# EAGLE design bms_board (EAGLE 6.6.0)
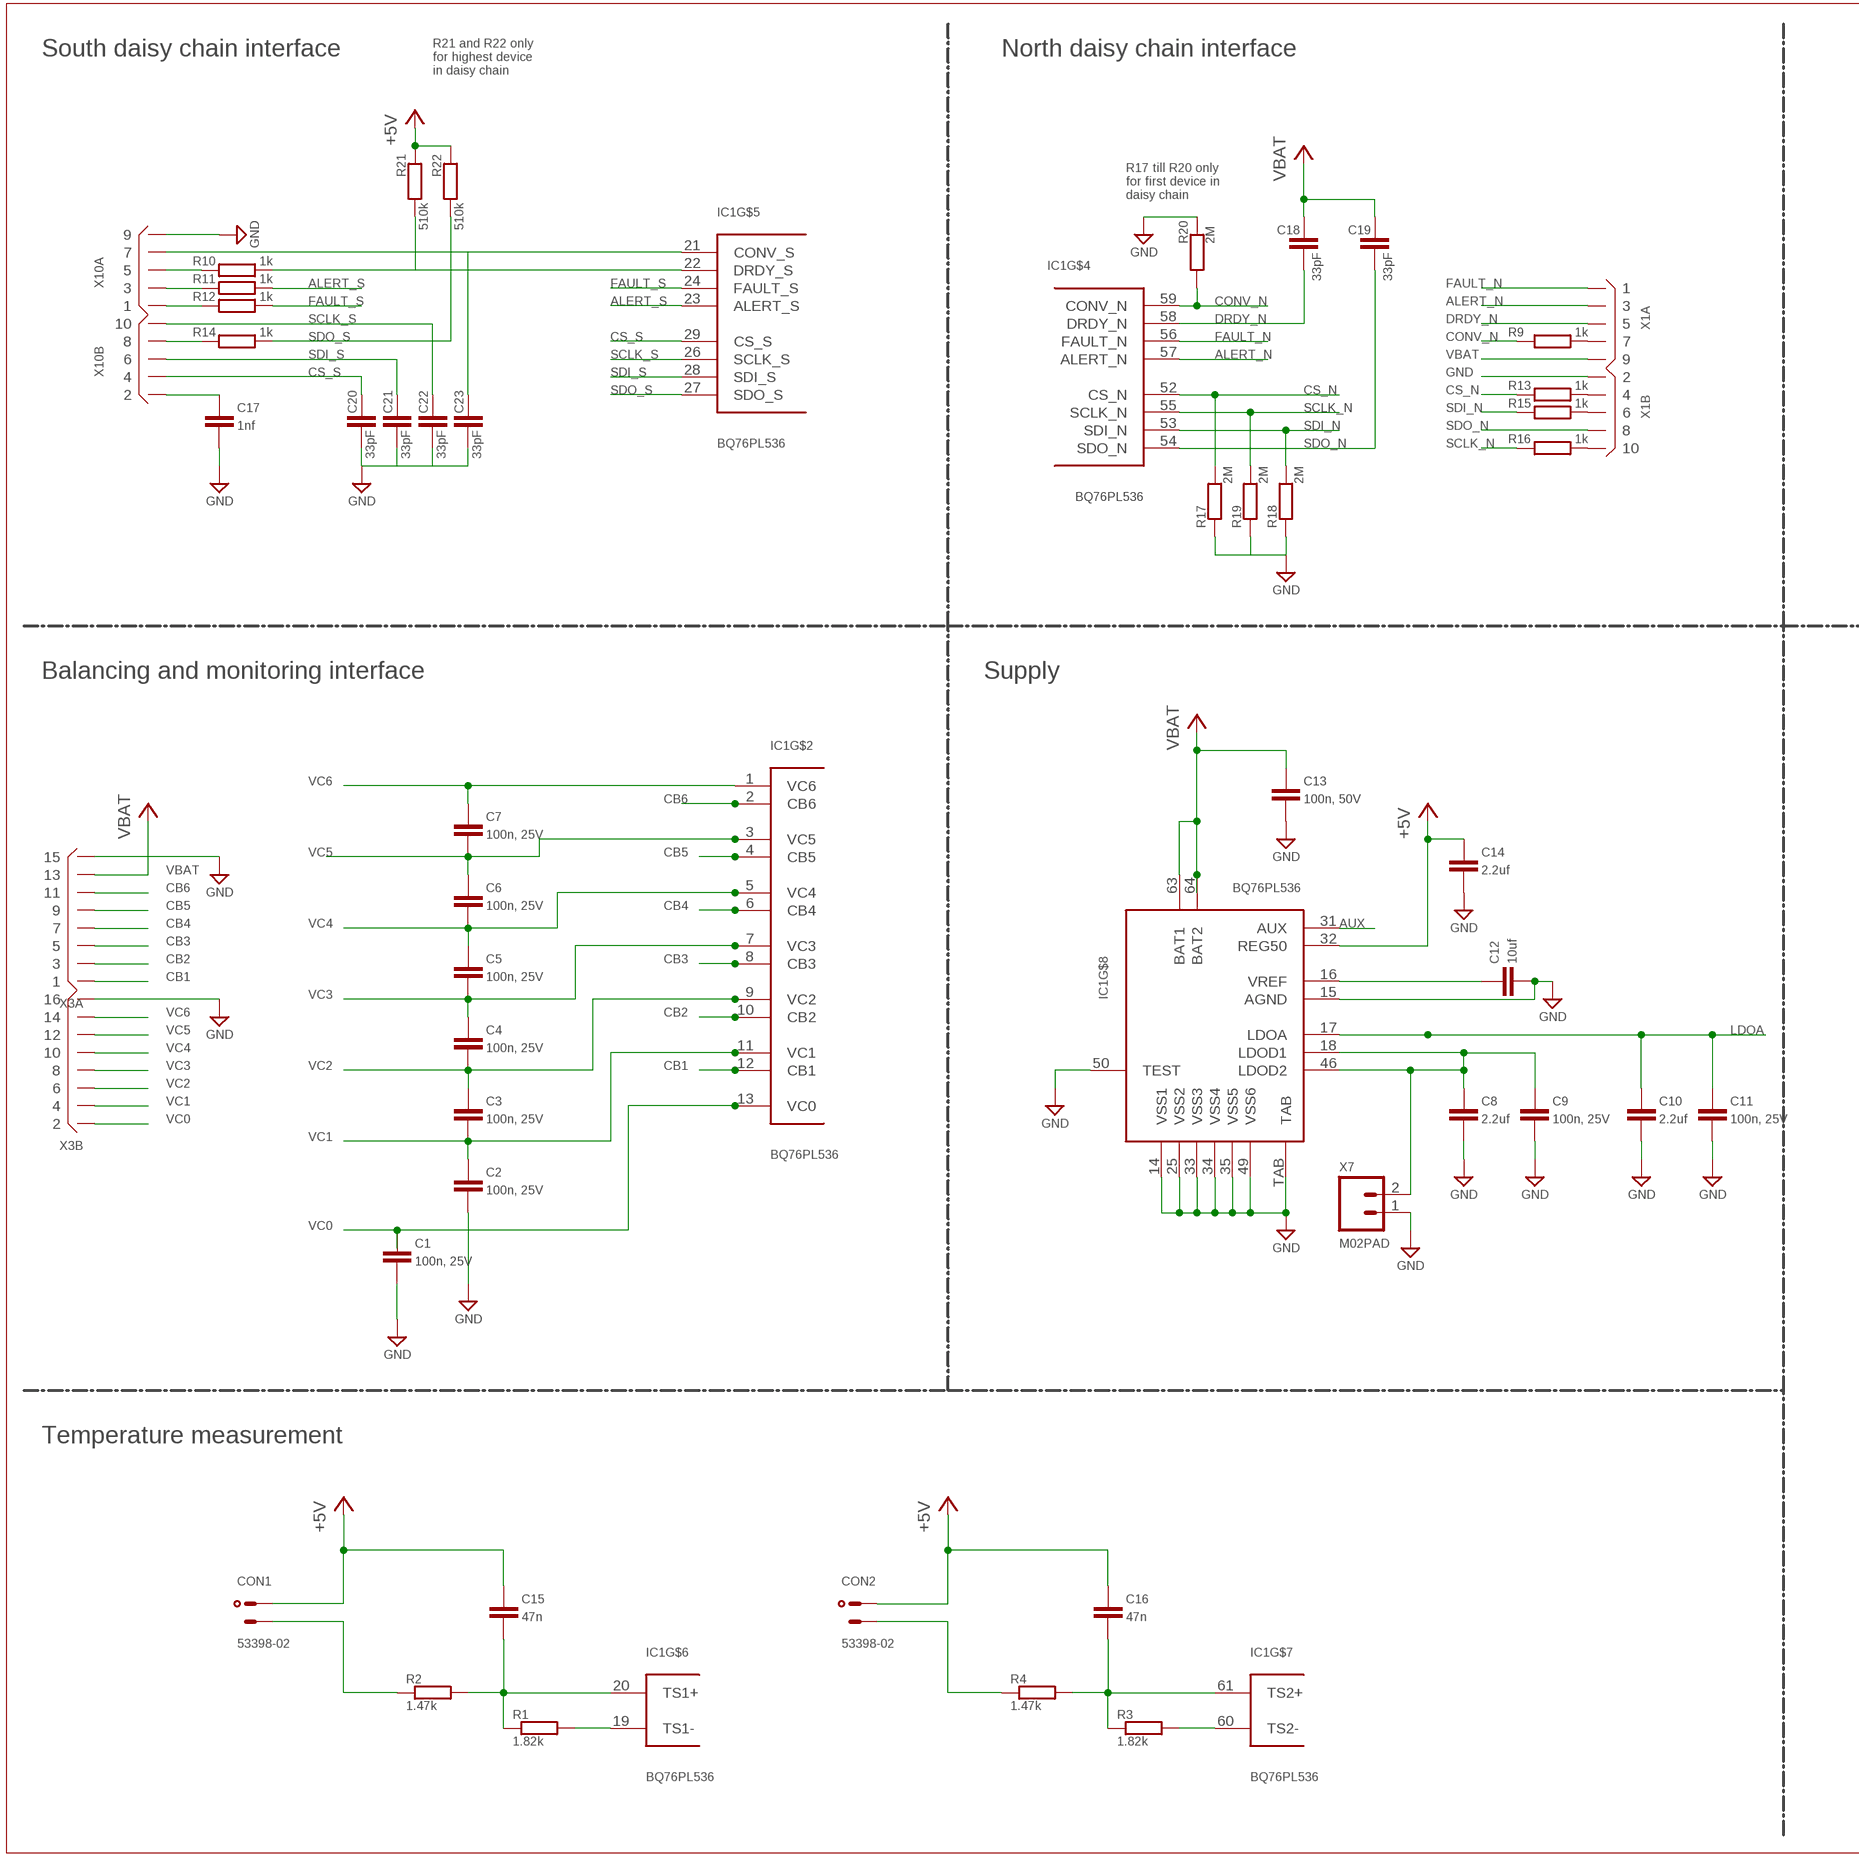
[diagram p0: schematic, sheet 1, part 1 of 2]
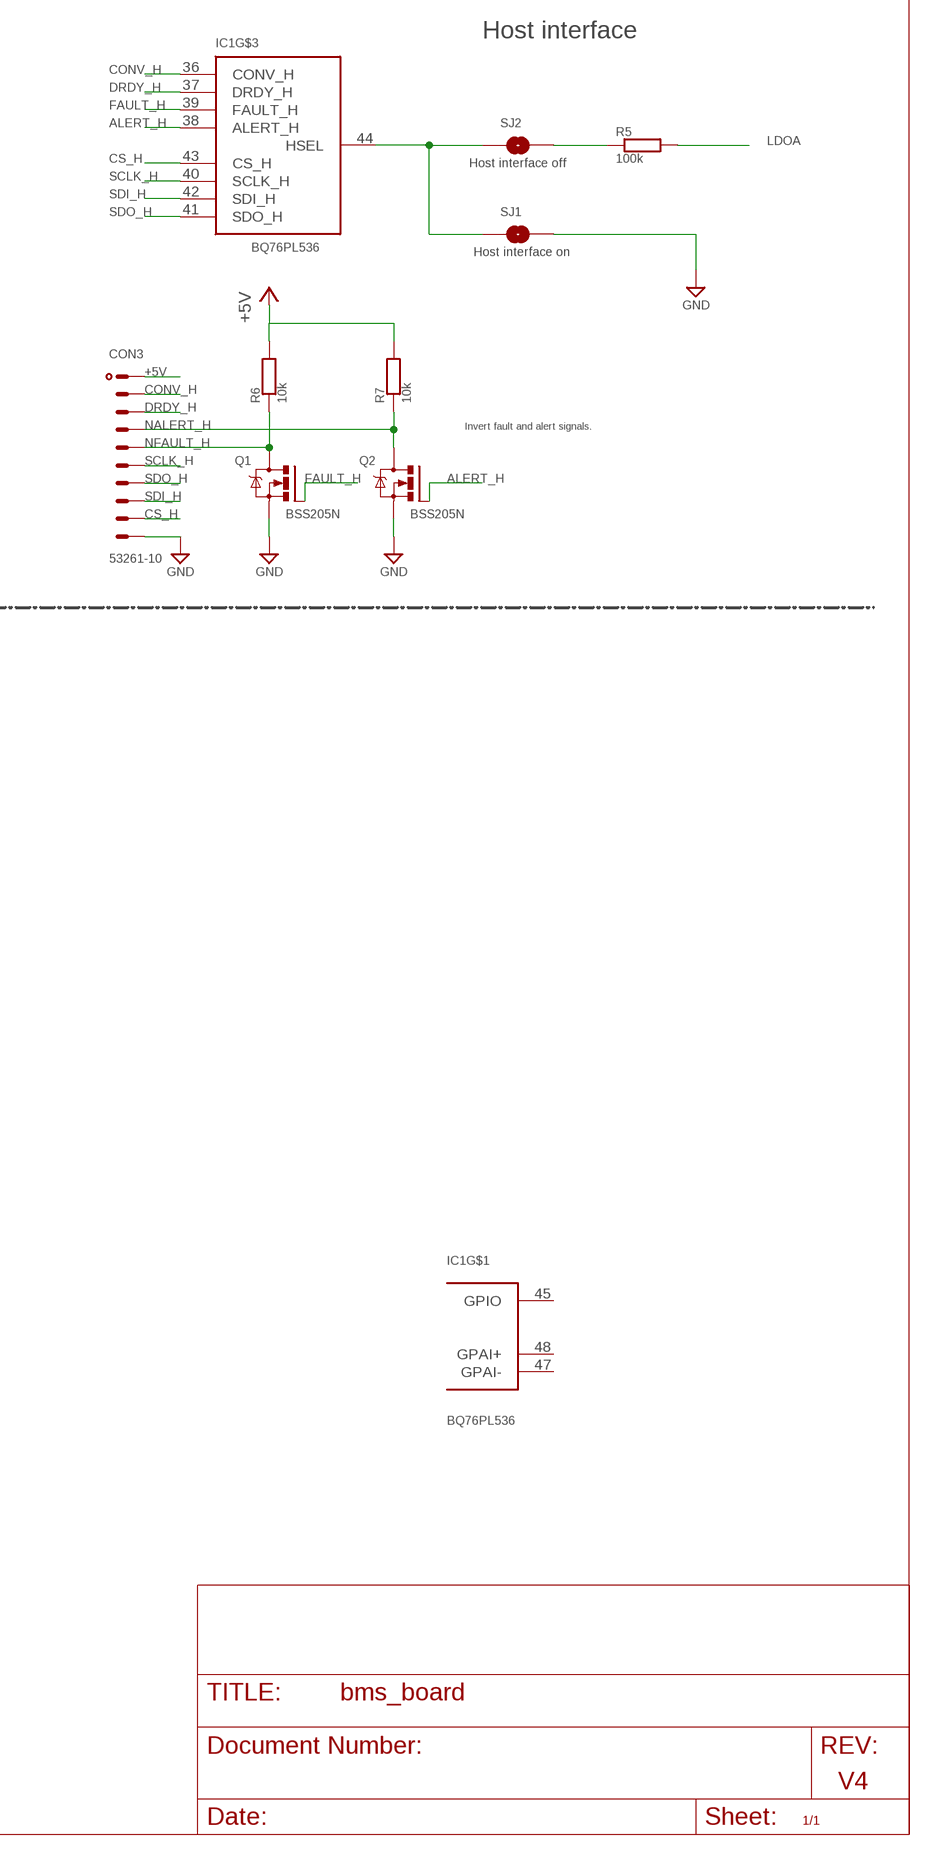
[diagram p1: schematic, sheet 1, part 2 of 2]

## Parts
C1  100n, 25V  C0603  [C0603]
C2  100n, 25V  C0603  [C0603]
C3  100n, 25V  C0603  [C0603]
C4  100n, 25V  C0603  [C0603]
C5  100n, 25V  C0603  [C0603]
C6  100n, 25V  C0603  [C0603]
C7  100n, 25V  C0603  [C0603]
C8  2.2uf  CSTD  [C0805]
C9  100n, 25V  CSTD  [C0805]
C10  2.2uf  CSTD  [C0805]
C11  100n, 25V  CSTD  [C0805]
C12  10uf  CSTD  [C0805]
C13  100n, 50V  CSTD  [C0805]
C14  2.2uf  CSTD  [C0805]
C15  47n  CSTD  [C0805]
C16  47n  CSTD  [C0805]
C17  1nf  CSTD  [C0805]
C18  33pF  C0603  [C0603]
C19  33pF  C0603  [C0603]
C20  33pF  C0603  [C0603]
C21  33pF  C0603  [C0603]
C22  33pF  C0603  [C0603]
C23  33pF  C0603  [C0603]
CON1  53398-02  [53398-02]
CON2  53398-02  [53398-02]
CON3  53261-10  [53261-10]
IC1  BQ76PL536  [LQFP-64]
Q1  BSS205N  [SOT23]
Q2  BSS205N  [SOT23]
R1  1.82k  R  [R0805]
R2  1.47k  R  [R0805]
R3  1.82k  R  [R0805]
R4  1.47k  R  [R0805]
R5  100k  R  [R0805]
R6  10k  R  [R0805]
R7  10k  R  [R0805]
R9  1k  R0603  [R0603]
R10  1k  R0603  [R0603]
R11  1k  R0603  [R0603]
R12  1k  R0603  [R0603]
R13  1k  R0603  [R0603]
R14  1k  R0603  [R0603]
R15  1k  R0603  [R0603]
R16  1k  R0603  [R0603]
R17  2M  R0603  [R0603]
R18  2M  R0603  [R0603]
R19  2M  R0603  [R0603]
R20  2M  R0603  [R0603]
R21  510k  R0603  [R0603]
R22  510k  R0603  [R0603]
SJ1  SOLDERJUMPERNO  [SJ_2S-NO]
SJ2  SOLDERJUMPERNO  [SJ_2S-NO]
X1  X05X2IDC-H  [X10R-IDC-H]
X3  X08X2DR  [X16R-DIL]
X7  M02PAD  [1X02]
X10  X05X2IDC-H  [X10R-IDC-H]

## Nets
+5V: C14.2 C15.2 C16.2 CON1.1 CON2.1 CON3.1 IC1.32(REG50) R6.2 R7.2 R21.2 R22.2
ALERT_H: IC1.38(ALERT_H) Q2.1(G)
ALERT_N: IC1.57(ALERT_N) X1.3
ALERT_S: IC1.23(ALERT_S) R11.2
AUX: IC1.31(AUX)
CB1: IC1.12(CB1) X3.1
CB2: IC1.10(CB2) X3.3
CB3: IC1.8(CB3) X3.5
CB4: IC1.6(CB4) X3.7
CB5: IC1.4(CB5) X3.9
CB6: IC1.2(CB6) X3.11
CONV_H: CON3.2 IC1.36(CONV_H)
CONV_N: IC1.59(CONV_N) R9.1 R20.2
CONV_S: C23.1 IC1.21(CONV_S) X10.7
CS_H: CON3.9 IC1.43(CS_H)
CS_N: IC1.52(CS_N) R13.1 R17.2
CS_S: C20.1 IC1.29(CS_S) X10.4
DRDY_H: CON3.3 IC1.37(DRDY_H)
DRDY_N: C18.2 IC1.58(DRDY_N) X1.5
DRDY_S: IC1.22(DRDY_S) R10.2 R21.1
FAULT_H: IC1.39(FAULT_H) Q1.1(G)
FAULT_N: IC1.56(FAULT_N) X1.1
FAULT_S: IC1.24(FAULT_S) R12.2
GND: C1.1 C2.1 C8.1 C9.1 C10.1 C11.1 C12.1 C13.1 C14.1 C17.1 C20.2 C21.2 C22.2 C23.2 CON3.10 IC1.14(VSS1) IC1.15(AGND) IC1.25(VSS2) IC1.33(VSS3) IC1.34(VSS4) IC1.35(VSS5) IC1.49(VSS6) IC1.50(TEST) IC1.TAB Q1.2(S) Q2.2(S) R17.1 R18.1 R19.1 R20.1 SJ1.2 X1.2 X3.15 X3.16 X7.1 X10.9
LDOA: C10.2 C11.2 IC1.17(LDOA) R5.2
N$1: IC1.44(HSEL) SJ1.1 SJ2.1
N$2: C8.2 C9.2 IC1.18(LDOD1) IC1.46(LDOD2) X7.2
N$3: C12.2 IC1.16(VREF)
N$4: IC1.19(TS1-) R1.2
N$5: CON1.2 R2.1
N$6: C15.1 IC1.20(TS1+) R1.1 R2.2
N$7: IC1.60(TS2-) R3.2
N$8: C16.1 IC1.61(TS2+) R3.1 R4.2
N$9: CON2.2 R4.1
N$10: R5.1 SJ2.2
N$11: R9.2 X1.7
N$12: R13.2 X1.4
N$13: R15.2 X1.6
N$23: R16.2 X1.10
N$25: R14.1 X10.8
N$27: R12.1 X10.1
N$28: R11.1 X10.3
N$29: R10.1 X10.5
N$32: C17.2 X10.2
NALERT_H: CON3.4 Q2.3(D) R7.1
NFAULT_H: CON3.5 Q1.3(D) R6.1
SCLK_H: CON3.6 IC1.40(SCLK_H)
SCLK_N: IC1.55(SCLK_N) R16.1 R19.2
SCLK_S: C22.1 IC1.26(SCLK_S) X10.10
SDI_H: CON3.8 IC1.42(SDI_H)
SDI_N: IC1.53(SDI_N) R15.1 R18.2
SDI_S: C21.1 IC1.28(SDI_S) X10.6
SDO_H: CON3.7 IC1.41(SDO_H)
SDO_N: C19.2 IC1.54(SDO_N) X1.8
SDO_S: IC1.27(SDO_S) R14.2 R22.1
VBAT: C13.2 C18.1 C19.1 IC1.63(BAT1) IC1.64(BAT2) X1.9 X3.13
VC0: C1.2 IC1.13(VC0) X3.2
VC1: C2.2 C3.1 IC1.11(VC1) X3.4
VC2: C3.2 C4.1 IC1.9(VC2) X3.6
VC3: C4.2 C5.1 IC1.7(VC3) X3.8
VC4: C5.2 C6.1 IC1.5(VC4) X3.10
VC5: C6.2 C7.1 IC1.3(VC5) X3.12
VC6: C7.2 IC1.1(VC6) X3.14
Unconnected: IC1.45(GPIO) IC1.47(GPAI-) IC1.48(GPAI+)

## Notes on the sheet
- South daisy chain interface | North daisy chain interface | Host interface
- R21 and R22 only
  for highest device
  in daisy chain
- Host interface off
- R17 till R20 only
  for first device in
  daisy chain
- Host interface on
- Invert fault and alert signals.
- Balancing and monitoring interface | Supply
- Temperature measurement
- V4

## Library data of the parts
C1-C23 = useful:C
CON1 CON2 = con-molex:53?-02: CONNECTOR wire to board 1.25 mm (.049 inch) pitch header
CON3 = con-molex:53?-10: CONNECTOR wire to board 1.25 mm (.049 inch) pitch header
IC1 = ti:BQ76PL536
Q1 Q2 = infineon:BSS205N: Infineon Small Signal Transistor, OptiMOS 2 Technology, 20V, 2.5A SOT23
R1-R7 R9-R22 = useful:R
SJ1 SJ2 = useful:SOLDERJUMPER: Solder Jumper Standard SMD solder jumper. Used to automate production. Two varients : Normally Open and Normally Closed are the same, but have different paste layers. NC will have a large amount of paste and should jumper during reflow.
X1 X10 = connectors:X05X2: Connector 2x5 pins
X3 = connectors:X08X2: Connector 2x8 pins
X7 = stiftleisten:M02

## Board
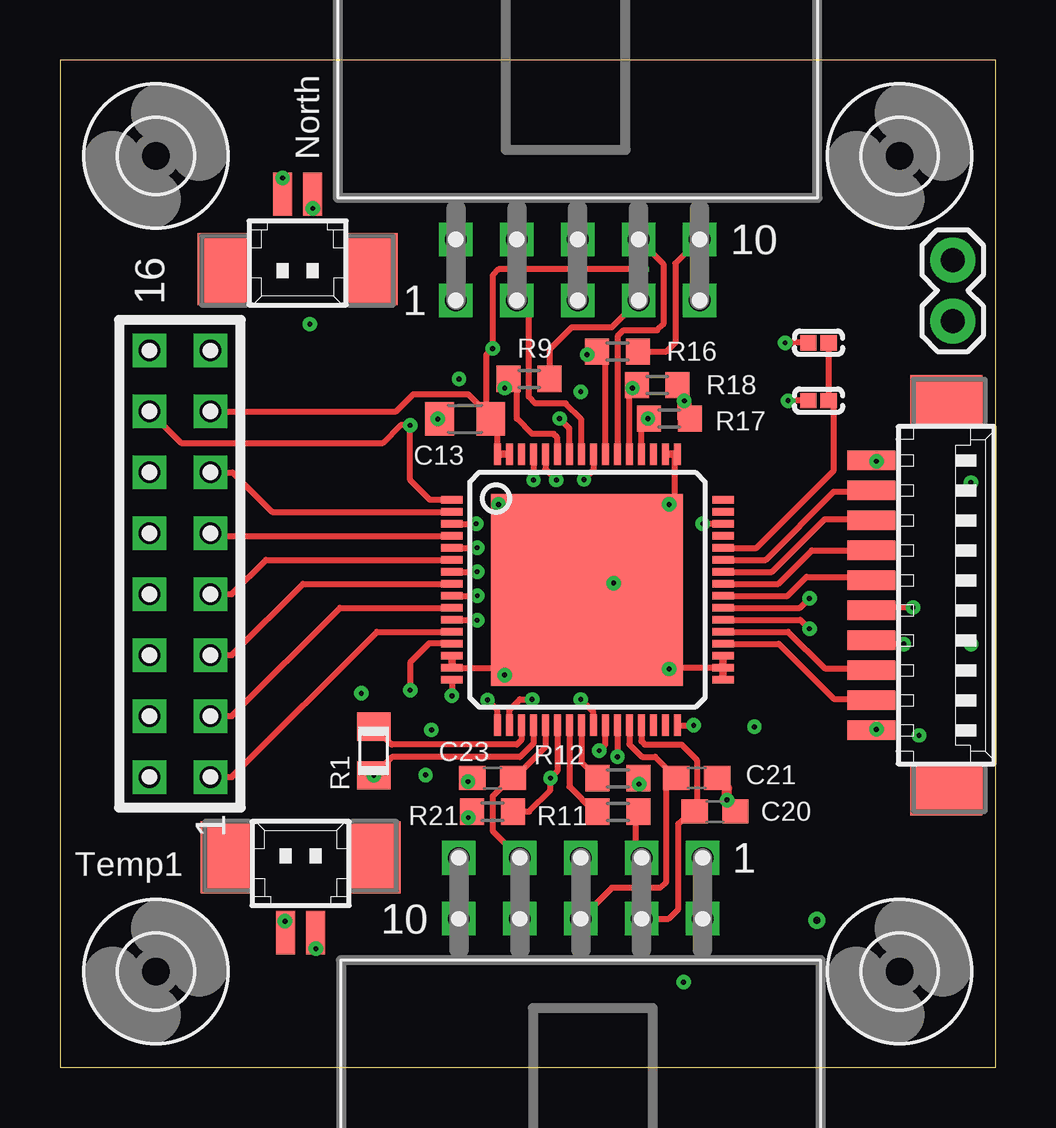
[diagram p2: board, top side]
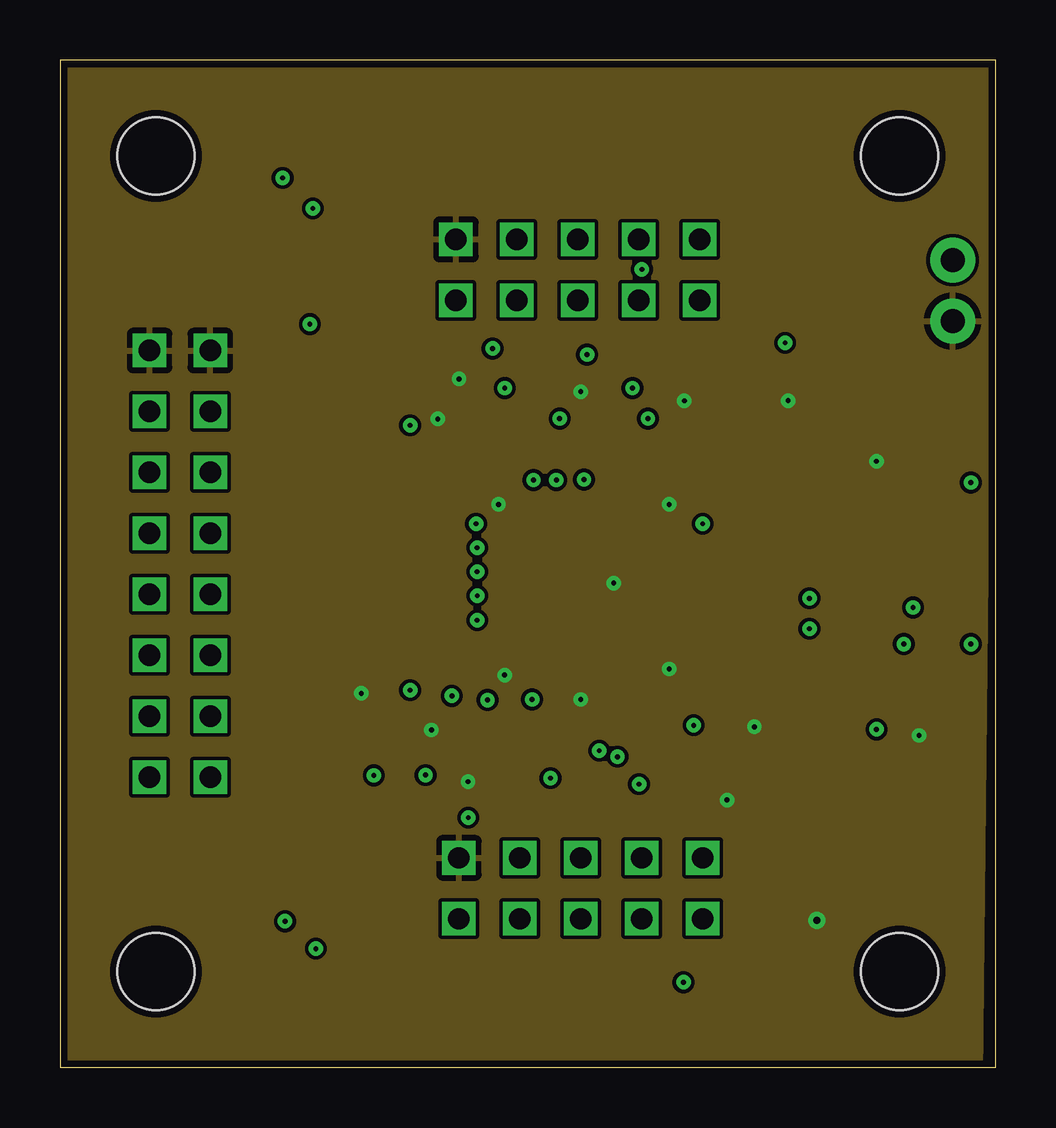
[diagram p3: board, inner layer Route2]
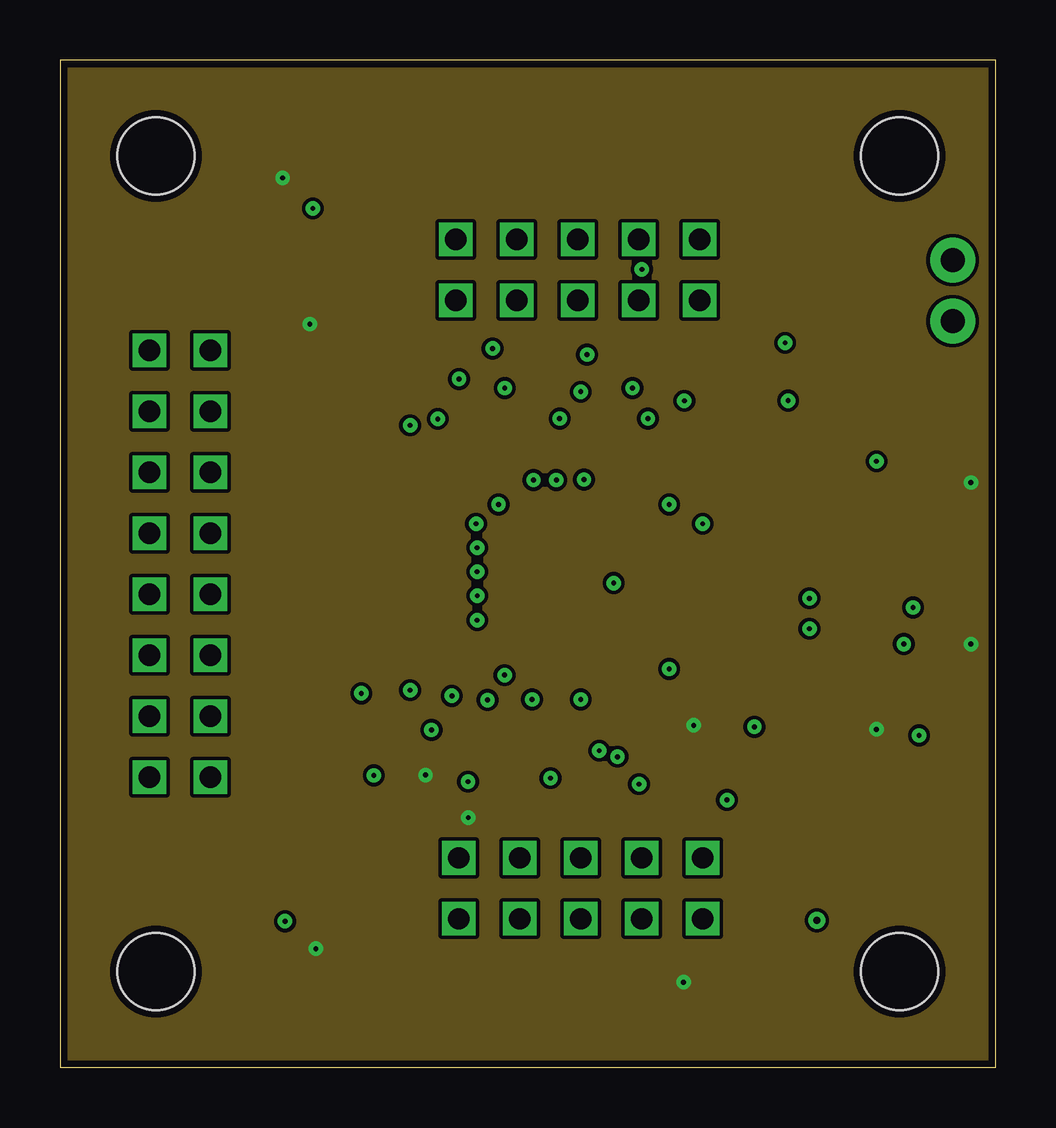
[diagram p4: board, inner layer Route15]
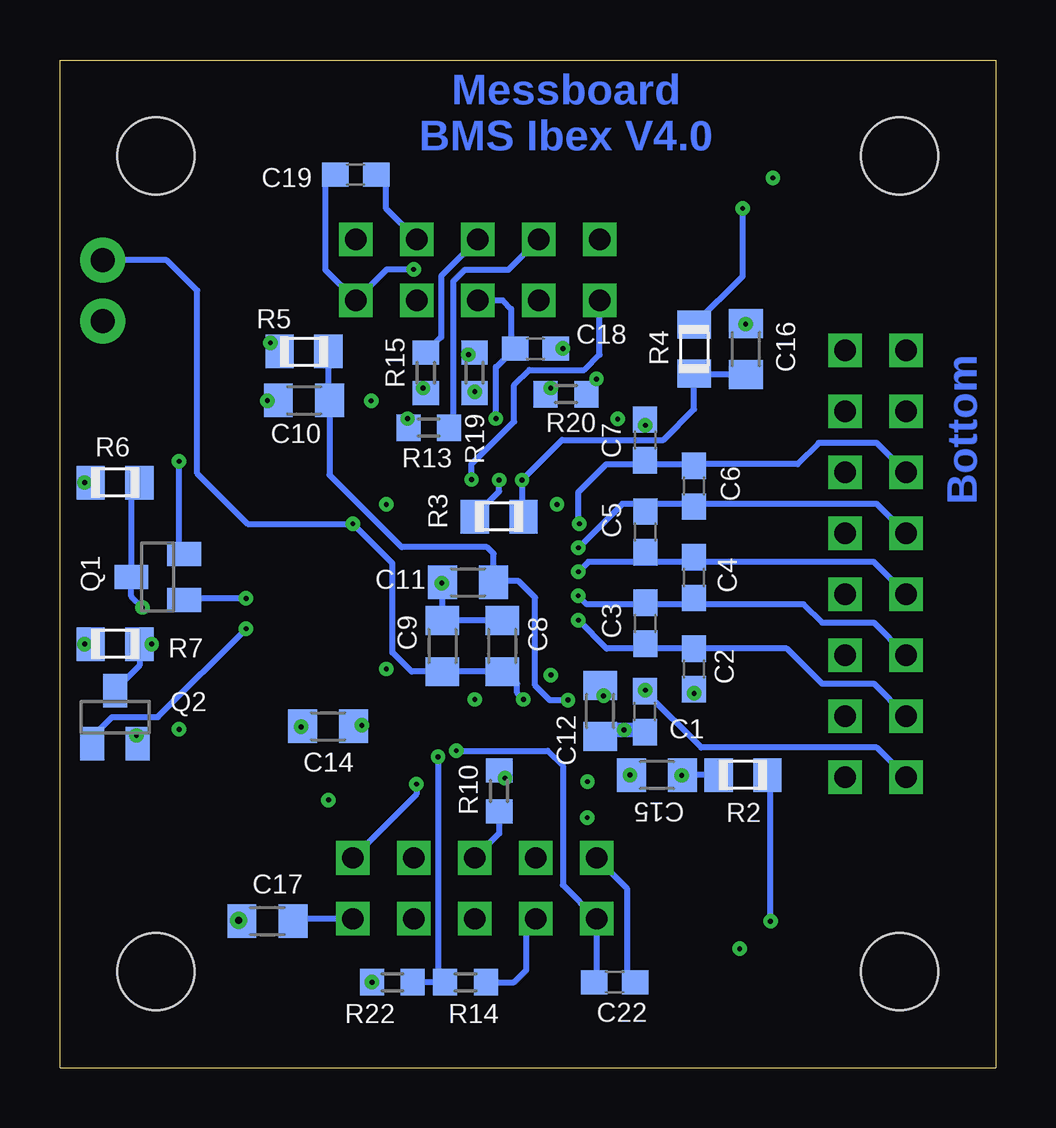
[diagram p5: board, bottom side, seen from below]

Size 39 x 42 mm. Coordinates in mm from the lower left corner, seen from the top.
Outline: 39,0 39,42 0,42 0,0 39,0
Copper layers (1+2*15+16): Top 0.035mm / dielectric 0.2mm / Route2 0.035mm / dielectric 0.5mm / Route15 0.035mm / dielectric 0.2mm / Bottom 0.035mm
Design rules "ats_35u_4layer_2 *": minimum track width 10mil, minimum drill 0.2mm, track to track 6mil, track to pad 6mil, pad to pad 6mil, via to via 6mil, smd to smd 6mil, copper to edge 0.3mm, drill to drill 8mil, minimum pad ring 10mil, minimum via ring 0.2mm, stop-mask expansion 4mil, vias tented up to drill 0mil, thermal gap 10mil

### Footprints (pad centres in the part's own frame; a part is rotated, then mirrored left to right if it is on the bottom)
C0603 = smd 1.1 x 1: 1 -0.85,0; 2 0.85,0
C0805 = smd 1.2 x 1.4: 1 -1.066,0; 2 1.066,0
53398-02 = smd 0.8 x 1.8: 1 0.625,-2.5; 2 -0.625,-2.5 | smd 2.1 x 3: S1 3.125,0.625; S2 -3.125,0.625
53261-10 = smd 0.8 x 2: 1 5.625,-2.5; 2 4.375,-2.5; 3 3.125,-2.5; 4 1.875,-2.5; 5 0.625,-2.5; 6 -0.625,-2.5; 7 -1.875,-2.5; 8 -3.125,-2.5; 9 -4.375,-2.5; 10 -5.625,-2.5 | smd 2.1 x 3: S1 8.125,0.625; S2 -8.125,0.625
LQFP-64 = smd 0.9 x 0.3: 1 -5.625,3.75; 2 -5.625,3.25; 3 -5.625,2.75; 4 -5.625,2.25; 5 -5.625,1.75; 6 -5.625,1.25; 7 -5.625,0.75; 8 -5.625,0.25; 9 -5.625,-0.25; 10 -5.625,-0.75; 11 -5.625,-1.25; 12 -5.625,-1.75; 13 -5.625,-2.25; 14 -5.625,-2.75; 15 -5.625,-3.25; 16 -5.625,-3.75; 33 5.675,-3.75; 34 5.675,-3.25; 35 5.675,-2.75; 36 5.675,-2.25; 37 5.675,-1.75; 38 5.675,-1.25; 39 5.675,-0.75; 40 5.675,-0.25; 41 5.675,0.25; 42 5.675,0.75; 43 5.675,1.25; 44 5.675,1.75; 45 5.675,2.25; 46 5.675,2.75; 47 5.675,3.25; 48 5.675,3.75 | smd 0.3 x 0.9: 17 -3.725,-5.65; 18 -3.225,-5.65; 19 -2.725,-5.65; 20 -2.225,-5.65; 21 -1.725,-5.65; 22 -1.225,-5.65; 23 -0.725,-5.65; 24 -0.225,-5.65; 25 0.275,-5.65; 26 0.775,-5.65; 27 1.275,-5.65; 28 1.775,-5.65; 29 2.275,-5.65; 30 2.775,-5.65; 31 3.275,-5.65; 32 3.775,-5.65; 49 3.775,5.65; 50 3.275,5.65; 51 2.775,5.65; 52 2.275,5.65; 53 1.775,5.65; 54 1.275,5.65; 55 0.775,5.65; 56 0.275,5.65; 57 -0.225,5.65; 58 -0.725,5.65; 59 -1.225,5.65; 60 -1.725,5.65; 61 -2.225,5.65; 62 -2.725,5.65; 63 -3.225,5.65; 64 -3.725,5.65 | smd 8 x 8: TAB 0,0
SOT23 = smd 1 x 1.4: 1 -0.95,-1.1; 2 0.95,-1.1; 3 0,1.1
R0805 = smd 1.168 x 1.397: 1 -1.016,0; 2 1.016,0
R0603 = smd 1 x 1.1: 1 -0.85,0; 2 0.85,0
SJ_2S-NO = smd 0.686 x 0.635: 1 -0.425,0; 2 0.425,0
3,2 = hole 3.2: 0,0
X10R-IDC-H = drill 0.889 pad 1.397 square: 1 -5.08,-1.27; 2 -5.08,1.27; 3 -2.54,-1.27; 4 -2.54,1.27; 5 0,-1.27; 6 0,1.27; 7 2.54,-1.27; 8 2.54,1.27; 9 5.08,-1.27; 10 5.08,1.27
X16R-DIL = drill 0.889 pad 1.397 square: 1 -8.89,-1.27; 2 -8.89,1.27; 3 -6.35,-1.27; 4 -6.35,1.27; 5 -3.81,-1.27; 6 -3.81,1.27; 7 -1.27,-1.27; 8 -1.27,1.27; 9 1.27,-1.27; 10 1.27,1.27; 11 3.81,-1.27; 12 3.81,1.27; 13 6.35,-1.27; 14 6.35,1.27; 15 8.89,-1.27; 16 8.89,1.27
1X02 = drill 1 pad 1.88: 1 0,0; 2 2.54,0

### Placement (x,y rotation side)
C1  14.61,14.84 90 bottom
C2  12.56,16.61 90 bottom
C3  14.6,18.52 90 bottom
C4  12.56,20.42 90 bottom
C5  14.6,22.33 90 bottom
C6  12.56,24.23 90 bottom
C7  14.61,26.16 90 bottom
C8  20.57,17.57 270 bottom
C9  23.06,17.57 270 bottom
C10  28.83,27.81 0 bottom
C11  21.99,20.22 0 bottom
C12  16.49,14.87 90 bottom
C13  16.89,27.04 0 top
C14  27.82,14.22 0 bottom
C15  14.11,12.19 180 bottom
C16  10.41,29.95 90 bottom
C17  30.35,6.11 0 bottom
C18  19.18,29.97 180 bottom
C19  26.67,37.21 0 bottom
C20  27.3,10.67 0 top
C21  26.54,12.06 0 top
C22  15.88,3.56 0 bottom
C23  18.03,12.06 180 top
CON1  10.03,8.13 0 top
CON2  9.91,33.91 180 top
CON3  36.32,19.68 270 top
IC1  21.96,19.92 0 top
Q1  34.92,20.45 90 bottom
Q2  36.7,14.61 0 bottom
R1  13.08,13.19 90 top
R2  10.53,12.19 180 bottom
R3  20.69,22.96 180 bottom
R4  12.56,29.95 270 bottom
R5  28.83,29.84 0 bottom
R6  36.7,24.38 180 bottom
R7  36.7,17.65 180 bottom
R9  19.56,28.7 0 top
R10  20.69,11.53 90 bottom
R11  23.26,10.66 180 top
R12  23.26,12.06 180 top
R13  23.62,26.67 0 bottom
R14  22.1,3.56 180 bottom
R15  23.75,28.96 90 bottom
R16  23.24,29.84 0 top
R17  25.4,27.05 180 top
R18  24.89,28.45 180 top
R19  21.72,28.96 90 bottom
R20  17.91,28.07 180 bottom
R21  18.03,10.67 180 top
R22  25.15,3.56 180 bottom
SJ1  31.62,27.8 180 top
SJ2  31.62,30.21 180 top
U$1  [3,2]  35,4 0 top
U$3  [3,2]  4,38 0 top
U$4  [3,2]  4,4 0 top
U$6  [3,2]  35,38 0 top
X1  21.58,33.25 0 top
X3  5,21 90 top
X7  37.21,31.12 90 top
X10  21.71,7.47 180 top

### Tracks (layer width: path | path; a pad name or v marks a point on that pad's centre or on a via)
+5V  (via drill 0.2)
  Top 0.254: CON2.1 v9.28,37.08 | IC1.32 v26.42,14.27 | v17.02,10.41 17.02,10.5 R21.2 | CON1.1 10.66,4.96 v10.67,4.95 | CON3.1 34,14.06 v34.04,14.1
  Bottom 0.254: 10.41,31.11 C16.2 10.41,31.01 v10.41,30.99 | R6.2 v37.97,24.38 | R7.2 v37.97,17.65 | C14.2 26.71,14.27 v26.42,14.27 | v25.99,3.56 R22.2 | v15.24,12.19 C15.2
  pour Route15: 0.11,51.01 39.11,50.97 39.11,-0.14 -0.02,0.3
ALERT_H  (via drill 0.2)
  Top 0.254: IC1.38 30.86,18.67 v31.24,18.29
  Bottom 0.254: 37.65,13.91 Q2.1 37.65,13.78 36.83,14.61 34.92,14.61 v31.24,18.29
ALERT_N
  Top 0.254: IC1.57 21.72,25.59 21.72,27.05 21.08,27.69 19.81,27.69 19.55,27.95 19.55,31.47 X1.3
ALERT_S
  Top 0.254: IC1.23 21.24,11.71 22.29,10.66 R11.2
CB1
  Top 0.254: X3.1 7.16,12.11 13.21,18.17 IC1.12
CB2
  Top 0.254: X3.3 7.16,14.65 11.67,19.17 IC1.10
CB3
  Top 0.254: X3.5 7.16,17.19 10.13,20.17 IC1.8
CB4
  Top 0.254: X3.7 7.16,19.73 8.59,21.17 IC1.6
CB5
  Top 0.254: X3.9 6.37,22.17 IC1.4
CB6
  Top 0.254: X3.11 7.19,24.81 8.84,23.17 IC1.2
CONV_H
  Top 0.254: 33.77,15.37 32.26,15.37 29.96,17.67 IC1.36
  Top 0.406: CON3.2 33.77,15.31 33.77,15.37
CONV_N  (via drill 0.2)
  Top 0.254: IC1.59 20.74,26.25 20.57,26.42 19.68,26.42 19.05,27.05 19.05,28.36 R9.1 18.71,28.49 v18.54,28.32
  Bottom 0.254: v18.54,28.32 18.54,28.28 R20.2
CONV_S
  Top 0.254: IC1.21 20.24,13.37 18.94,12.06 C23.1 18.8,12.06 18.03,11.3 18.03,9.88 X10.7
CS_H
  Top 0.254: 33.77,24 32.26,24 29.42,21.17 IC1.43
  Top 0.406: CON3.9 33.77,24.06 33.77,24
CS_N  (via drill 0.2)
  Top 0.254: R17.2 v24.51,27.05 24.24,26.78 IC1.52
  Bottom 0.254: 24.51,27.01 v24.51,27.05 24.47,27.01 R13.1
CS_S
  Top 0.254: IC1.29 24.24,13.61 24.38,13.46 25.91,13.46 26.54,12.83 26.54,10.76 C20.1 26.29,10.67 25.78,10.16 25.78,6.6 25.38,6.2 X10.4
DRDY_H
  Top 0.254: 33.74,16.64 31.88,16.64 30.35,18.17 IC1.37
  Top 0.406: CON3.3 33.74,16.56 33.74,16.64
DRDY_N  (via drill 0.2)
  Top 0.254: IC1.58 21.24,26.64 v20.83,27.05
  Bottom 0.254: v20.83,27.05 20.83,29.21 20.79,29.21 C18.2 20.19,30.14 20.19,31.62 20.55,31.98 X1.5
DRDY_S  (via drill 0.2)
  Top 0.254: IC1.22 20.74,12.36 v20.45,12.06 20.45,11.56 19.56,10.67 R21.1
  Bottom 0.254: R10.2 20.69,12.31 v20.45,12.06
FAULT_H  (via drill 0.2)
  Top 0.254: IC1.39 30.85,19.17 v31.24,19.56
  Bottom 0.254: v31.24,19.56 33.76,19.56 Q1.1
FAULT_N  (via drill 0.2)
  Top 0.254: IC1.56 22.24,24.91 v21.84,24.51
  Bottom 0.254: v21.84,24.51 21.84,25.15 20.07,26.92 20.07,28.45 19.43,29.08 17.14,29.08 16.51,29.72 X1.1
FAULT_S
  Top 0.254: 21.72,14.24 IC1.24 21.74,12.73 R12.2
GND  (via drill 0.2, 0.3)
  Top 0.254: 18.66,16.61 18.79,16.61 arc-127 v18.53,16.36 | v18.53,16.36 18.41,16.36 | IC1.15 18.23,16.67 v18.53,16.36 | 25.63,23.71 25.63,25.46 IC1.49 | 22.24,17.16 22.09,17.31 24.44,17.31 25.14,16.61 v25.39,16.61 25.44,16.67 IC1.34 | C13.1 v15.75,27.04 | SJ1.2 v30.35,27.8 | IC1.25 22.24,14.81 v21.71,15.34 | v17.01,11.91 17.03,11.91 C23.2 | 18.61,16.61 18.66,16.61 | 18.66,16.61 IC1.TAB | v26.03,27.79 26.03,28.16 R18.1 | v34.04,25.27 33.86,25.27 CON3.10
  Top 0.305: IC1.15 IC1.14 | 25.53,23.61 v25.39,23.47 25.63,23.71 | IC1.50 IC1.49 | 25.65,16.61 v25.39,16.61 | IC1.35 IC1.34 IC1.33
  Top 0.406: C20.2 28.16,10.8 v27.8,11.15 27.8,11.65 C21.2
  Top 0.61: R17.1 26.04,27.05 v26.04,27.78 v26.03,27.79
  Bottom 0.254: C8.1 C9.1 C11.1 v23.08,20.2 | Q1.2 34.04,21.61 v34.04,25.27 | C14.1 28.92,14.22 v28.95,14.2 | C2.1 v12.56,15.6 | R19.1 v21.72,28.16 v21.71,28.17 | X10.9 15.37,7.48 15.37,3.56 C22.2 | 16.09,14.07 16.21,14.07 C12.1 | C17.1 31.53,6.11 v31.55,6.14 | Q2.2 35.75,13.78 v35.81,13.84 | R20.1 17.06,28.28 v16.64,28.7 | C10.1 30.34,27.81 v30.35,27.8
  Bottom 0.61: 16.09,14.07 v15.49,14.07 14.7,14.07 C1.1
  other vias: 18.28,23.47
  pour Route2: -0.42,-0.27 38.37,-0.4 38.94,50.96 0.15,51.06
LDOA  (via drill 0.2)
  Top 0.254: IC1.17 18.24,14.9 v17.82,15.32
  Bottom 0.254: v17.82,15.32 18.59,15.32 19.19,15.93 19.19,19.59 19.88,20.27 20.88,20.27 C11.2 20.93,21.42 21.2,21.69 24.76,21.69 27.76,24.7 C10.2 27.81,27.86 R5.2
N$1
  Top 0.254: SJ2.1 SJ1.1 32.26,27.59 32.26,24.89 29.03,21.67 IC1.44
N$2  (via drill 0.2)
  Top 0.254: IC1.18 18.74,14.91 19.17,15.34 v19.68,15.34 | IC1.46 v26.79,22.67
  Bottom 0.254: X7.2 34.54,33.66 33.27,32.39 33.27,24.77 31.17,22.67 v26.79,22.67 25.14,21.02 25.14,17.3 24.34,16.5 C9.2 C8.2 20.44,16.5 19.94,16 19.94,15.62 19.68,15.36 v19.68,15.34
N$3  (via drill 0.2)
  Top 0.254: IC1.16 v16.34,15.49
  Bottom 0.254: C12.2 16.49,15.64 v16.34,15.49
N$4
  Top 0.254: IC1.19 19.24,13.65 19.05,13.46 13.83,13.46 R1.2
N$5  (via drill 0.2)
  Top 0.254: 9.41,5.82 CON1.2 9.38,5.65 v9.38,6.1
  Bottom 0.254: v9.38,6.1 9.38,12.06 R2.1
N$6  (via drill 0.2)
  Top 0.254: IC1.20 19.74,13.5 19.18,12.94 13.84,12.94 R1.1
  Bottom 0.254: R2.2 C15.1 13.07,12.19 R1.1
  other vias: 13.08,12.18
N$7  (via drill 0.2)
  Top 0.254: IC1.60 20.24,24.94 v20.69,24.49
  Bottom 0.254: R3.2 21.71,23 20.69,24.01 v20.69,24.49
N$8  (via drill 0.2)
  Top 0.254: IC1.61 v19.74,24.49
  Bottom 0.254: 12.52,28.88 R4.2 | C16.1 12.56,28.88 R4.2 | 12.57,28.93 R4.2 | R4.2 12.56,27.44 13.84,26.16 18.06,26.16 v19.74,24.49 19.74,23.02 R3.1
N$9  (via drill 0.2)
  Top 0.254: 10.53,36.08 CON2.2 10.54,36.4 v10.54,35.81
  Bottom 0.254: R4.1 10.54,32.99 v10.54,35.81
N$10  (via drill 0.2)
  Top 0.254: SJ2.2 v30.23,30.21
  Bottom 0.254: R5.1 29.86,29.84 v30.23,30.21
N$11
  Top 0.254: R9.2 20.41,29.93 21.34,30.86 23,30.86 X1.7
N$12
  Bottom 0.254: X1.4 20.32,33.24 22.13,33.24 22.61,32.77 22.61,26.84 R13.2
N$13
  Bottom 0.254: X1.6 23.11,32.99 23.11,30.44 R15.2
N$23
  Top 0.254: X1.10 25.65,33.51 25.65,30.23 25.27,29.84 R16.2
N$25
  Bottom 0.254: R14.1 20.07,3.56 19.56,4.06 19.56,5.81 X10.8
N$27  (via drill 0.2)
  Top 0.254: R12.1 24.14,12.06 v24.14,11.81
  Bottom 0.254: v24.14,11.81 24.14,11.39 X10.1
N$28
  Top 0.254: R11.1 24,10.55 24,8.99 X10.3
N$29
  Bottom 0.254: R10.1 20.69,9.76 X10.5
N$32
  Bottom 0.254: X10.2 29.29,6.2 C17.2
NALERT_H  (via drill 0.2)
  Top 0.254: CON3.4 34.54,17.81 34.54,17.65 v35.18,17.65
  Bottom 0.254: v35.18,17.65 R7.1 35.69,16.76 36.7,15.75 Q2.3
NFAULT_H  (via drill 0.2)
  Top 0.254: v35.56,19.18 33.94,19.18 CON3.5
  Bottom 0.254: v35.56,19.18 36.02,19.64 Q1.3 36.02,24.05 R6.1
SCLK_H
  Top 0.254: IC1.40 30.33,19.67 31.11,20.45 33.69,20.45
  Top 0.406: CON3.6 33.69,20.31 33.69,20.45
SCLK_N  (via drill 0.2)
  Top 0.254: IC1.55 22.74,29.5 R16.1 22.26,29.72 v21.97,29.72
  Bottom 0.254: R19.2 21.88,29.81 v21.97,29.72
SCLK_S  (via drill 0.2)
  Top 0.254: v22.48,13.21 22.74,13.47 IC1.26
  Bottom 0.254: v22.48,13.21 18.67,13.21 18.03,12.57 18.03,7.61 X10.10 16.63,3.65 C22.1
SDI_H
  Top 0.254: 33.77,22.86 31.88,22.86 29.68,20.67 IC1.42
  Top 0.406: CON3.8 33.77,22.81 33.77,22.86
SDI_N  (via drill 0.2)
  Top 0.254: 23.75,28.45 R18.2 23.74,28.14 | IC1.53 23.74,28.14 | 23.74,28.14 23.74,28.19 v23.86,28.32
  Bottom 0.254: R15.1 23.75,28.2 v23.86,28.32
SDI_S
  Top 0.254: IC1.28 23.74,13.47 24.26,12.95 24.8,12.95 C21.1 25.27,11.64 25.27,7.75 25.02,7.49 23,7.49 X10.6
SDO_H
  Top 0.254: IC1.41 29.95,20.17 31.34,21.56 CON3.7
  Top 0.406: CON3.7 33.73,21.56 33.73,21.46
SDO_N
  Top 0.254: X1.8 25.15,33.5 25.15,30.99 24.89,30.73 23.5,30.73 23.24,30.48 IC1.54
  Bottom 0.254: X1.8 25.4,35.8 25.4,36.79 C19.2
SDO_S  (via drill 0.2)
  Top 0.254: IC1.27 23.24,13.08 v23.24,12.95
  Bottom 0.254: R22.1 R14.2 23.24,3.85 v23.24,12.95
VBAT  (via drill 0.2)
  Top 0.254: v24.26,33.27 18.29,33.27 18.03,33.02 v18.03,29.97 17.78,29.72 17.78,27.56 17.96,27.38 17.96,27.13 | IC1.64 18.24,26.75 C13.2 17.96,27.13 | X3.13 14.02,27.35 14.73,28.07 17.02,28.07 17.96,27.13
  Top 0.305: IC1.63 IC1.64
  Bottom 0.254: v24.26,33.27 25.37,33.27 X1.9 27.94,33.26 27.94,36.79 C19.1 | v18.03,29.97 C18.1
VC0  (via drill 0.2)
  Top 0.254: IC1.13 16.32,17.68 15.39,17.68 14.6,16.88 v14.6,15.72
  Bottom 0.254: X3.2 4.96,13.34 12.26,13.34 C1.2 14.6,15.7 v14.6,15.72
VC1  (via drill 0.2)
  Top 0.254: IC1.11 17.37,18.67 v17.39,18.65
  Bottom 0.254: X3.4 5.08,16 7.24,16 8.7,17.46 C2.2 14.61,17.46 | v17.39,18.65 16.21,17.46 14.61,17.46 | C3.1 14.6,17.47 14.61,17.46
VC2  (via drill 0.2)
  Top 0.254: IC1.9 v17.4,19.67
  Bottom 0.254: X3.6 5.08,18.54 7.24,18.54 8,19.3 12.57,19.3 | 12.57,19.3 14.61,19.3 | 14.61,19.3 17.04,19.3 v17.4,19.67 | C4.1 12.56,19.31 12.57,19.3 | C3.2 14.6,19.31 14.61,19.3
VC3  (via drill 0.2)
  Top 0.254: IC1.7 v17.39,20.67
  Bottom 0.254: X3.8 5.08,21.08 12.57,21.08 | 12.57,21.08 14.61,21.08 | 14.61,21.08 16.98,21.08 v17.39,20.67 | C5.1 14.6,21.09 14.61,21.08 | C4.2 12.56,21.09 12.57,21.08
VC4  (via drill 0.2)
  Top 0.254: IC1.5 v17.39,21.67
  Bottom 0.254: X3.10 4.96,23.5 12.57,23.5 | 12.57,23.5 14.61,23.5 | 14.61,23.5 15.56,23.5 v17.39,21.67 | C6.1 12.56,23.49 12.57,23.5 | C5.2 14.6,23.49 14.61,23.5
VC5  (via drill 0.2)
  Top 0.254: IC1.3 v17.35,22.67
  Bottom 0.254: v17.35,22.67 17.39,22.71 17.39,23.98 16.23,25.15 14.61,25.15 | X3.12 4.96,26.04 7.37,26.04 8.26,25.15 12.5,25.15 C6.2 12.57,25.08 12.57,25.15 14.61,25.15 | C7.1 14.61,25.15
VC6  (via drill 0.2)
  Top 0.254: IC1.1 15.42,23.67 14.6,24.49 v14.6,26.77 14.2,26.77 13.46,26.04 5.04,26.04 X3.14
  Bottom 0.254: C7.2 14.61,26.78 v14.6,26.77

### Text on the board
Bottom: Messboard / BMS Ibex V4.0 | Bottom
tPlace: North
tNames: Temp1
tTest: HOST / off | 7V | Temp2 | HOST / on | Messboard / BMS Ibex V4.0 | TERA TU Graz, / Pöschl & Moni